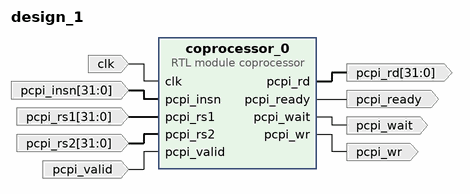
[diagram p0: block diagram of the top level]
# Vivado block design design_1, xc7z020clg400-1, Vivado 2018.2
create_bd_design design_1

create_bd_port -dir I -type clk clk
set_property -dict {CONFIG.FREQ_HZ 100000000} [get_bd_ports clk]
create_bd_port -dir I -from 31 -to 0 pcpi_insn
create_bd_port -dir O -from 31 -to 0 pcpi_rd
create_bd_port -dir O pcpi_ready
create_bd_port -dir I -from 31 -to 0 pcpi_rs1
create_bd_port -dir I -from 31 -to 0 pcpi_rs2
create_bd_port -dir I pcpi_valid
create_bd_port -dir O pcpi_wait
create_bd_port -dir O pcpi_wr

create_bd_cell -type module -reference coprocessor coprocessor_0

# ---- connections ----

connect_bd_net [get_bd_ports clk] [get_bd_pins coprocessor_0/clk]
connect_bd_net [get_bd_pins coprocessor_0/pcpi_rd] [get_bd_ports pcpi_rd]
connect_bd_net [get_bd_pins coprocessor_0/pcpi_ready] [get_bd_ports pcpi_ready]
connect_bd_net [get_bd_pins coprocessor_0/pcpi_wait] [get_bd_ports pcpi_wait]
connect_bd_net [get_bd_pins coprocessor_0/pcpi_wr] [get_bd_ports pcpi_wr]
connect_bd_net [get_bd_ports pcpi_insn] [get_bd_pins coprocessor_0/pcpi_insn]
connect_bd_net -net pcpi_rs1_1 [get_bd_ports pcpi_rs1] [get_bd_pins coprocessor_0/pcpi_rs1]
connect_bd_net -net pcpi_rs2_1 [get_bd_ports pcpi_rs2] [get_bd_pins coprocessor_0/pcpi_rs2]
connect_bd_net [get_bd_ports pcpi_valid] [get_bd_pins coprocessor_0/pcpi_valid]

validate_bd_design
save_bd_design
